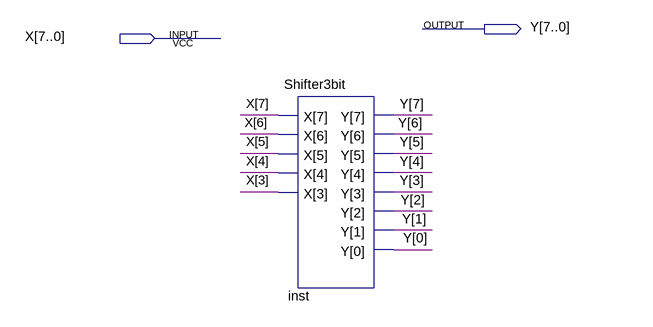
[diagram p0: schematic sheet]
// Quartus schematic SHIFT3.bdf as structural Verilog: 1 symbols, 2 pins
module SHIFT3 (
  input  [7:0] X,
  output [7:0] Y
);

  Shifter3bit inst (.X(X[7:3]), .Y(Y));
endmodule
